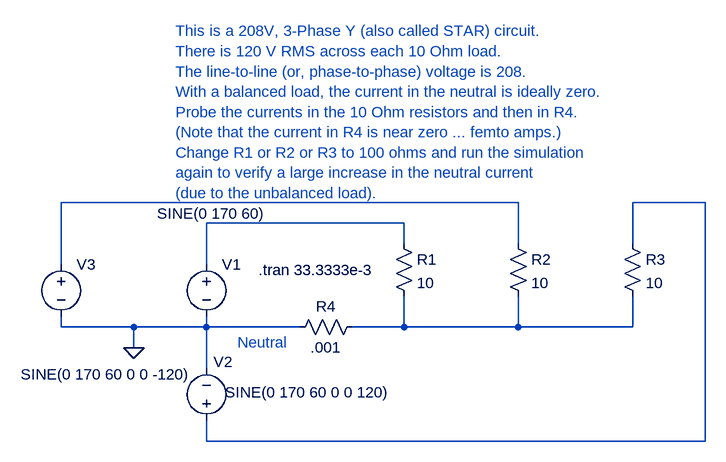
[diagram p0: schematic 3Phase.asc]
3Phase.asc, the LTspice schematic file:
Version 4
SHEET 1 880 680
WIRE 560 96 -144 96
WIRE 848 96 736 96
WIRE 384 128 80 128
WIRE 384 160 384 128
WIRE 560 160 560 96
WIRE 736 160 736 96
WIRE -144 192 -144 96
WIRE 80 192 80 128
WIRE -144 288 -144 272
WIRE -32 288 -144 288
WIRE 80 288 80 272
WIRE 80 288 -32 288
WIRE 224 288 80 288
WIRE 384 288 384 240
WIRE 384 288 304 288
WIRE 560 288 560 240
WIRE 560 288 384 288
WIRE 736 288 736 240
WIRE 736 288 560 288
WIRE -32 320 -32 288
WIRE 80 352 80 288
WIRE 80 464 80 432
WIRE 848 464 848 96
WIRE 848 464 80 464
FLAG -32 320 0
SYMBOL voltage 80 176 R0
WINDOW 3 -76 -63 Left 0
WINDOW 123 0 0 Left 0
WINDOW 39 0 0 Left 0
SYMATTR Value SINE(0 170 60)
SYMATTR InstName V1
SYMBOL voltage -144 176 R0
WINDOW 3 -62 185 Left 0
WINDOW 123 0 0 Left 0
WINDOW 39 0 0 Left 0
SYMATTR Value SINE(0 170 60 0 0 -120)
SYMATTR InstName V3
SYMBOL res 368 144 R0
SYMATTR InstName R1
SYMATTR Value 10
SYMBOL res 544 144 R0
SYMATTR InstName R2
SYMATTR Value 10
SYMBOL res 720 144 R0
SYMATTR InstName R3
SYMATTR Value 10
SYMBOL res 320 272 R90
WINDOW 0 0 56 VBottom 0
WINDOW 3 32 56 VTop 0
SYMATTR InstName R4
SYMATTR Value .001
SYMBOL voltage 80 448 R180
WINDOW 0 -40 106 Left 0
WINDOW 3 -283 59 Left 0
WINDOW 123 0 0 Left 0
WINDOW 39 0 0 Left 0
SYMATTR InstName V2
SYMATTR Value SINE(0 170 60 0 0 120)
TEXT 160 200 Left 0 !.tran 33.3333e-3
TEXT 128 312 Left 0 ;Neutral
TEXT 32 -168 Left 0 ;This is a 208V, 3-Phase Y (also called STAR) circuit.\nThere is 120 V RMS across each 10 Ohm load.\nThe line-to-line (or, phase-to-phase) voltage is 208.\nWith a balanced load, the current in the neutral is ideally zero.\nProbe the currents in the 10 Ohm resistors and then in R4.\n(Note that the current in R4 is near zero ... femto amps.)\nChange R1 or R2 or R3 to 100 ohms and run the simulation\nagain to verify a large increase in the neutral current\n(due to the unbalanced load).

The netlist it stands for:
* 3Phase.asc
V1 N003 0 SINE(0 170 60)
V3 N001 0 SINE(0 170 60 0 0 -120)
R1 N003 N004 10
R2 N001 N004 10
R3 N002 N004 10
R4 N004 0 .001
V2 N002 0 SINE(0 170 60 0 0 120)
.tran 33.3333e-3
* Neutral
* This is a 208V, 3-Phase Y (also called STAR) circuit.
* There is 120 V RMS across each 10 Ohm load.
* The line-to-line (or, phase-to-phase) voltage is 208.
* With a balanced load, the current in the neutral is ideally zero.
* Probe the currents in the 10 Ohm resistors and then in R4.
* (Note that the current in R4 is near zero ... femto amps.)
* Change R1 or R2 or R3 to 100 ohms and run the simulation
* again to verify a large increase in the neutral current
* (due to the unbalanced load).
.backanno
.end